# Altium schematic sheet nfc.SchDoc
size A4; SheetNumber: 5; SheetTotal: 7
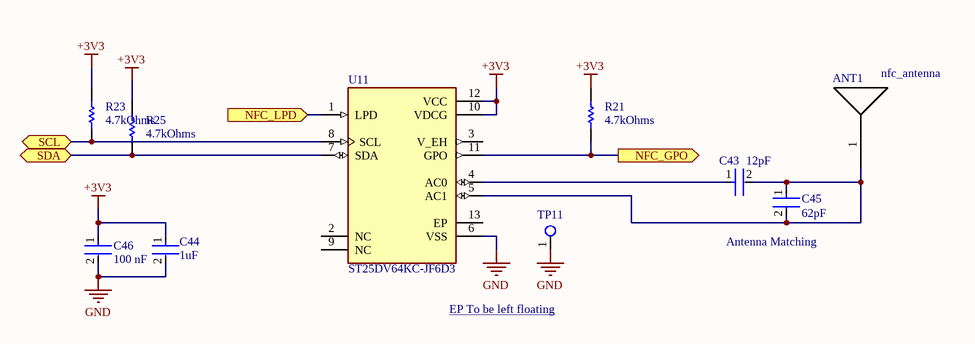
[diagram p0: nfc.SchDoc]

## Parts
ANT1  nfc_antenna  [nfc_antenna]
C43  Capacitance: 12pF  [FP-GRM155-0_05-MFG]  (hidden comment: GRM1555C1H120GA01D)
C44  Capacitance: 1uF  [FP-CL10-IPC_C]  (hidden comment: CL10B105KP8NNNC)
C45  value 62pF  [FP-GCM155-0_05-IPC_B]  (hidden comment: GCM1555C1H620GA16J)
C46  Capacitance: 100 nF  [FP-CC0603-DA-MFG]  (hidden comment: CC0603KRX7R7BB104)
R21  Resistance: 4.7kOhms  [RESC1608X55X25LL10T15]  (hidden comment: RC0603FR-074K7L)
R23  Resistance: 4.7kOhms  [RESC1608X55X25LL10T15]  (hidden comment: RC0603FR-074K7L)
R25  Resistance: 4.7kOhms  [RESC1608X55X25LL10T15]  (hidden comment: RC0603FR-074K7L)
TP11  Test Point  [test_point]  (value not drawn)
U11  ST25DV64KC-JF6D3  [PSON50P300X300X60-13N]

## Ports
NFC_GPO (out, see top[2C], mcu[2B]), NFC_LPD (in, see top[2C], mcu[2B]), SCL (bidir, see top[2C], mcu[2B], pd[2C]), SDA (bidir, see top[2C], mcu[2B], pd[2C])

## Nets
+3V3: C44.1 C46.1 R21.2 R23.2 R25.2 U11.10(VDCG) U11.12(VCC)
GND: C44.2 C46.2 TP11.1 U11.6(VSS)
NFC_GPO: R21.1 U11.11(GPO) ; port NFC_GPO
NFC_LPD: U11.1(LPD) ; port NFC_LPD
SCL: R23.1 U11.8(SCL) ; port SCL
SDA: R25.1 U11.7(SDA) ; port SDA
NetANT1_1: ANT1.1 C43.2 C45.1 C45.2 U11.5(AC1)
NetC43_1: C43.1 U11.4(AC0)

Not connected (* = marked no-connect by the designer): U11 2(NC) 3(V_EH) 9(NC) 13(EP)

## Notes on the sheet
- (near C45) Antenna Matching
- EP To be left floating <https://www.st.com/resource/en/datasheet/st25dv16kc.pdf>

## Library data of the parts
C43 = CMP-2008-03945-2: CAP CER 12PF 50V C0G/NP0 0402; Tolerance: 2%; Dielectric: C0G; Material: Ceramic; Termination: SMD/SMT; Mount: Surface Mount; REACH SVHC: No SVHC; Depth: 0.5mm; Case Code (Metric): 1005; Voltage Rating: 50V; Height: 0.5mm; Voltage Rating (DC): 50V; Case Code (Imperial): 0402; Package Quantity: 10000; Construction: Flat; Thickness: 0.022inch; Length: 1mm; Min Operating Temperature: -55°C; Width: 0.5mm; Lead Free: Lead Free; Case/Package: 0402; Packaging: Tape and Reel; Series: GRM; Voltage: 50V; Radiation Hardening: No; Max Operating Temperature: 125°C
C44 = CMP-2000-06094-2: Cap Ceramic 1uF 10V X7R ±10% Pad SMD 0603 +125°C T/R; Packaging: Tape and Reel; Depth: 0.8mm; Voltage Rating: 10V; Lead Free: Lead Free; Radiation Hardening: No; Length: 1.6mm; Package Quantity: 1; Mount: Surface Mount; Case/Package: 0603; Max Operating Temperature: 125°C; Case Code (Metric): 1608; Height: 0.8mm; Min Operating Temperature: -55°C; Dielectric: X7R; Contact Plating: Tin; Case Code (Imperial): 0603; Thickness: 0.035inch; Voltage Rating (DC): 10V; Tolerance: 10%; Width: 0.031inch
C45 = CMP-06035-017743-1: Ceramic Capacitor for Automotive 62pF ±2% 50VDC C0G 0402 Paper T/R
C46 = CMP-2000-05002-2: CAP CER 0.1UF 16V X7R 0603; Manufacturer: YAGEO; Tolerance: 0.1; Value: 100 nF; Temperature Coefficient: 15%; Material: Ceramic; Voltage Rating: 16 V; Package: CC0603-DA; ComponentLink2Description: Datasheet; Octopart: https://octopart.com/cc0603krx7r7bb104-yageo-192941; Temperature Range High: +125°C; Digikey Description: CAP CER 0.1UF 16V X7R 0603; Voltage: 16 V; Device Class L2: Capacitors; Height: 0.9mm; Temperature: -55°C to +125°C; Manufacturer Part Number: CC0603KRX7R7BB104; Device Class L1: Passive Components; Device Class L3: Ceramic Capacitors; ComponentLink2URL: http://www.yageo.com/documents/recent/UPY-GPHC_X7R_6.3V-to-50V_18.pdf; Footprint Url: http://www.yageo.com/exep/pages/download/literatures/UPY-C_GEN_24.pdf; RoHS: TRUE; Temperature Range Low: -55°C; Temperature Characteristic: X7R; Lead Free: Yes; Category: Cap; Mouser Description: Multilayer Ceramic Capacitor, CC Series, 0.1 - F, - 10%, X7R, 16 V, 0603 [1608 Metric]; Automotive: No
R21 R23 R25 = CMP-2000-06942-1: Chip Resistor, 4.7 KOhm, +/- 1%, 0.1 W, -55 to 155 degC, 0603 (1608 Metric), RoHS, Tape and Reel; Manufacturer: Yageo; Power Rating: 100mW; Temperature Coefficient: 100PPM/C; Voltage Rating: 50V; Package Reference: 0603; Series: RC; Datasheet Version: Rev. 7, 05/2017; Packaging: Reel; Termination Style: SMD/SMT; Datasheet URL: http://www.yageo.com/documents/recent/PYu-RC_Group_51_RoHS_L_7.pdf; Manufacturer URL: http://www.yageo.com/; Package Description: 2-Pin Surface Mount Device, Body 1.6 x 0.8 mm; Case Code - mm: 1608; Case Code - in: 0603; Mounting Technology: SurfaceMount; Operating Temperature Range: -55Cto+155C; Tolerance: 1%; Product: ThickFilmResistorsGeneralPurpose